# Altium schematic sheet USB Host.SchDoc
size A
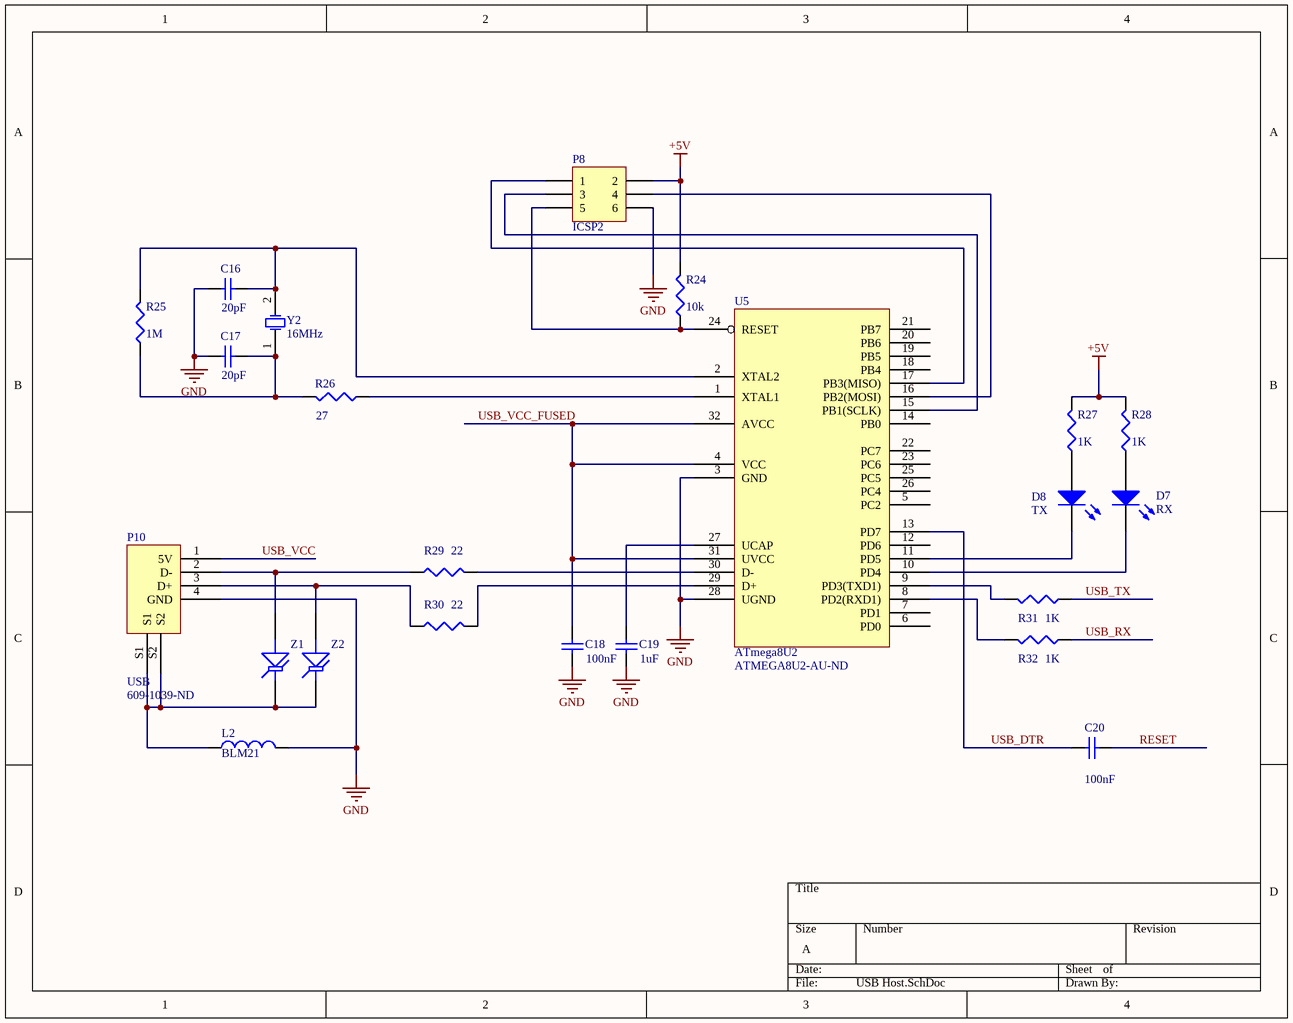
[diagram p0: USB Host.SchDoc]

## Parts
C16  value 20pF  [C1206]  (hidden comment: Cap Semi)
C17  value 20pF  [C1206]  (hidden comment: Cap Semi)
C18  value 100nF  [C1206]  (hidden comment: Cap Semi)
C19  value 1uF  [C1206]  (hidden comment: Cap Semi)
C20  value 100nF  [C1206]  (hidden comment: Cap Semi)
D7  RX  [HDR1X2]
D8  TX  [HDR1X2]
L2  value BLM21  [INDC2012M]  (hidden comment: Inductor)
P8  ICSP2  [HDR2X3]
P10  USB  Supplier Part Number 1: 609-1039-ND  [USB-B PN61729]
R24  value 10k  [RESC3216M]  (hidden comment: Res3)
R25  value 1M  [RESC3216M]  (hidden comment: Res3)
R26  value 27  [RESC3216M]  (hidden comment: Res3)
R27  value 1K  [RESC3216M]  (hidden comment: Res3)
R28  value 1K  [RESC3216M]  (hidden comment: Res3)
R29  value 22  [RESC3216M]  (hidden comment: Res3)
R30  value 22  [RESC3216M]  (hidden comment: Res3)
R31  value 1K  [RESC3216M]  (hidden comment: Res3)
R32  value 1K  [RESC3216M]  (hidden comment: Res3)
U5  ATmega8U2  Supplier Part Number 1: ATMEGA8U2-AU-ND  [QFP80P900X900-32M]
Y2  16MHz  [SMT Crystal]
Z1  Tranzorb  [CD1608-0603]  (value not drawn)
Z2  Tranzorb  [CD1608-0603]  (value not drawn)

## Nets
+5V: P8.2 R24.2 R27.2 R28.2
GND: C16.1 C17.2 C18.1 C19.1 L2.2 P8.6 P10.4(GND) U5.3(GND) U5.28(UGND)
RESET: C20.2
USB_DTR: C20.1 U5.13(PD7)
USB_RX: R32.1
USB_TX: R31.1
USB_VCC: P10.1(5V)
USB_VCC_FUSED: C18.2 U5.4(VCC) U5.31(UVCC) U5.32(AVCC)
NetC16_2: C16.2 R25.2 U5.2(XTAL2) Y2.2(OSC2)
NetC17_1: C17.1 R25.1 R26.2 Y2.1(OSC1)
NetC19_2: C19.2 U5.27(UCAP)
NetD7_1: D7.1(A) R28.1
NetD7_2: D7.2(K) U5.10(PD4)
NetD8_1: D8.1(A) R27.1
NetD8_2: D8.2(K) U5.11(PD5)
NetL2_1: L2.1 P10.S1 P10.S2 Z1.2(K) Z2.2(K)
NetP8_1: P8.1 U5.17(PB3(MISO))
NetP8_3: P8.3 U5.15(PB1(SCLK))
NetP8_4: P8.4 U5.16(PB2(MOSI))
NetP8_5: P8.5 R24.1 U5.24(RESET)
NetP10_2: P10.2(D-) R29.1 Z1.1(A)
NetP10_3: P10.3(D+) R30.1 Z2.1(A)
NetR26_1: R26.1 U5.1(XTAL1)
NetR29_2: R29.2 U5.30(D-)
NetR30_2: R30.2 U5.29(D+)
NetR31_2: R31.2 U5.9(PD3(TXD1))
NetR32_2: R32.2 U5.8(PD2(RXD1))

Not connected (* = marked no-connect by the designer): U5 5(PC2) 6(PD0) 7(PD1) 12(PD6) 14(PB0) 18(PB4) 19(PB5) 20(PB6) 21(PB7) 22(PC7) 23(PC6) 25(PC5) 26(PC4)

## Library data of the parts
C16-C20 = Cap Semi: Capacitor (Semiconductor SIM Model); Published: 8-Jun-2000; LatestRevisionDate: 29-May-2009; LatestRevisionNote: IPC-7351 Footprint Added.; PackageReference: C1206; Publisher: Altium Limited; PackageDescription: Chip Capacitor
D7 D8 = LED3: Typical BLUE SiC LED; Published: 8-Jun-2000; LatestRevisionDate: 17-Dec-2003; LatestRevisionNote: PCB Footprint replaced.; DatasheetVersion: 16-Apr-2002; PackageVersion: 16-Apr-2002; PackageReference: 3.5X2.8X1.9; Publisher: Altium Limited; PackageDescription: SM LED; 2 C-Bend Leads; Body 3.5 x 2.8 x 1.9 mm, inc leads (LxWxH typ)
L2 = Inductor: Code_IEC: 1005; Published: 8-Jun-2000; LatestRevisionDate: 29-May-2009; LatestRevisionNote: IPC-7351 Footprint Added.; PackageReference: 0402-A; Publisher: Altium Limited; PackageDescription: Chip Inductor; Code_JEITA: 0402
P8 = Header 3X2: Header, 3-Pin, Dual row; LatestRevisionDate: 17-Jul-2002; LatestRevisionNote: Re-released for DXP Platform.; Publisher: Altium Limited
R24-R32 = Res3: Resistor; Published: 8-Jun-2000; LatestRevisionDate: 29-May-2009; LatestRevisionNote: IPC-7351 Footprint Added.; PackageReference: J1-0603; Publisher: Altium Limited; PackageDescription: Chip Resistor
Y2 = XTAL: Crystal Oscillator; Published: 8-Jun-2000; LatestRevisionDate: 17-Jul-2002; LatestRevisionNote: Re-released for DXP Platform.; PackageReference: R38; Publisher: Altium Limited; PackageDescription: Crystal, Thru-Hole; 2 Leads; Body 3.1 x 8.2 mm (Dia.xH)
Z1 Z2 = Tranzorb: Transient Voltage Suppression (TVS) Diode; Published: 24-Mar-1999; LatestRevisionDate: 17-Jul-2002; LatestRevisionNote: Re-released for DXP Platform.; PackageReference: DO-7; Publisher: Altium Limited; PackageDescription: Axial Lead Diode
P10 = USB: Supplier 1: Digi-Key
U5 = ATmega8U2: Supplier 1: Digi-Key